# Altium schematic sheet EMMC_SDcard.SchDoc
size A4
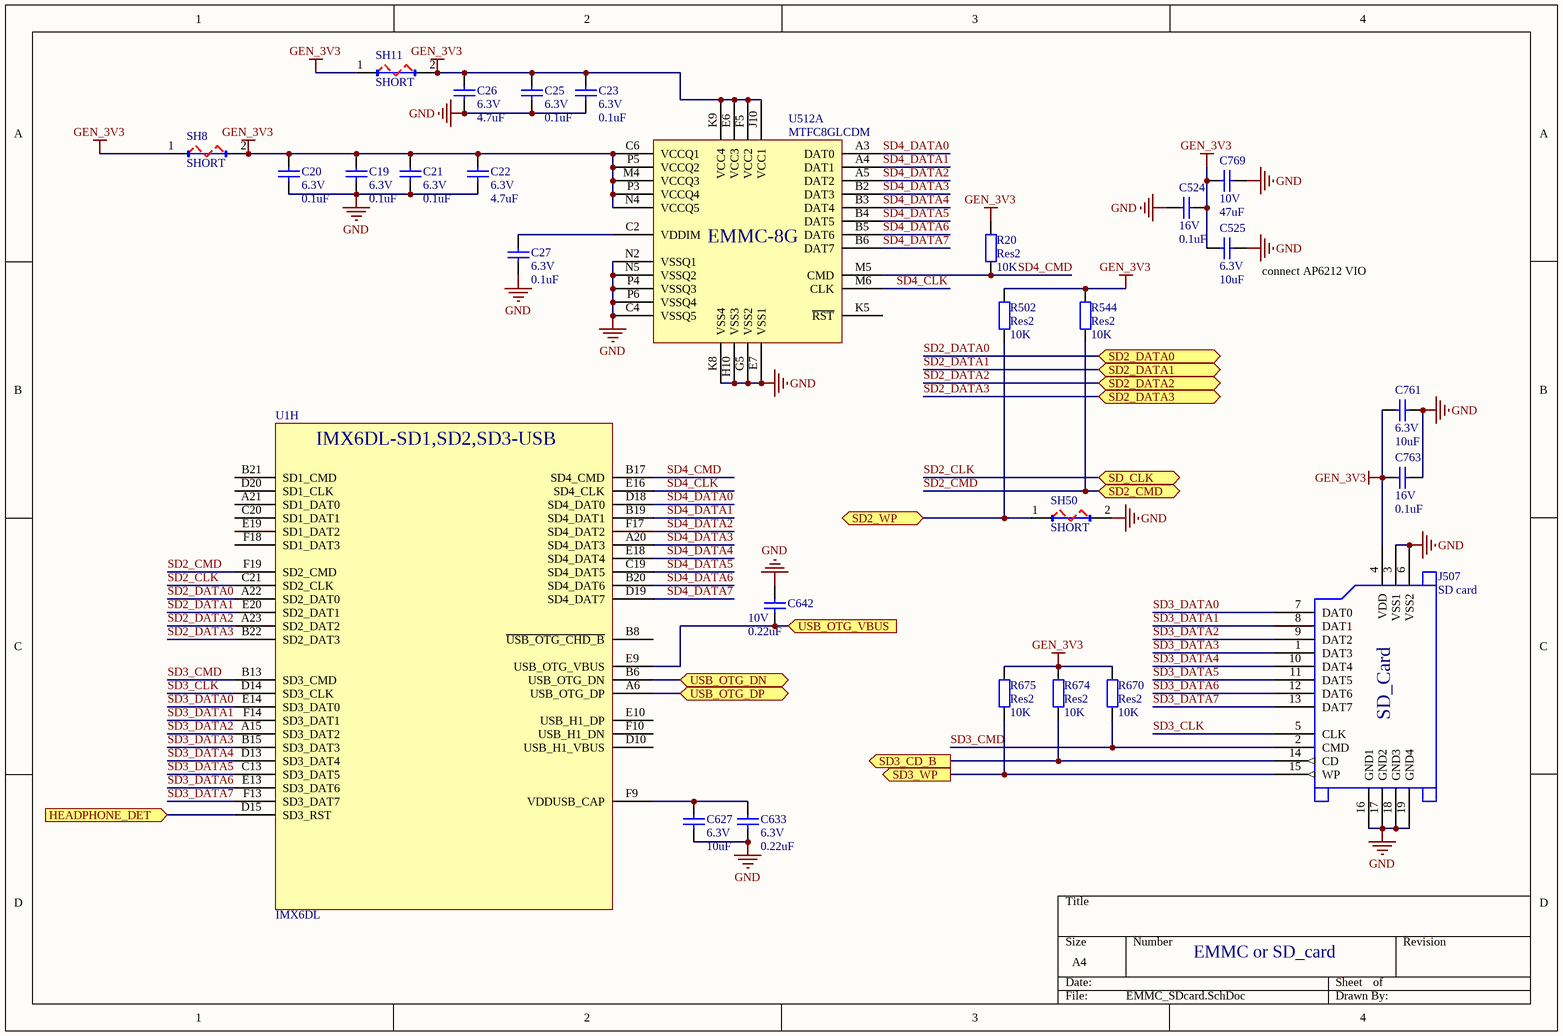
[diagram p0: EMMC_SDcard.SchDoc]

## Parts
C19  6.3V  value 0.1uF  [0201]
C20  6.3V  value 0.1uF  [0201]
C21  6.3V  value 0.1uF  [0201]
C22  6.3V  value 4.7uF  [0603]
C23  6.3V  value 0.1uF  [0201]
C25  6.3V  value 0.1uF  [0201]
C26  6.3V  value 4.7uF  [0603]
C27  6.3V  value 0.1uF  [0201]
C524  16V  value 0.1uF  [0402]
C525  6.3V  value 10uF  [0603]
C627  6.3V  value 10uF  [0603]
C633  6.3V  value 0.22uF  [0201]
C642  10V  value 0.22uF  [0201]
C761  6.3V  value 10uF  [0603]
C763  16V  value 0.1uF  [0402]
C769  10V  value 47uF  [nonpolarity_cap_1206]
J507  SD card  [SD_card]
R20  Res2  value 10K  [0402]
R502  Res2  value 10K  [0402]
R544  Res2  value 10K  [0402]
R670  Res2  value 10K  [0402]
R674  Res2  value 10K  [0402]
R675  Res2  value 10K  [0402]
SH8  SHORT  [SHORT_SH]
SH11  SHORT  [SHORT_SH]
SH50  SHORT  [SHORT_SH]
U1  IMX6DL  [IMX6DL-BGA624x25]  (part H of 8)
U512A  MTFC8GLCDM  [SDIN8DE2-4G-EMMC-BGA153]

## Ports
HEADPHONE_DET (in), SD2_CMD, SD2_DATA0, SD2_DATA1, SD2_DATA2, SD2_DATA3, SD2_WP, SD3_CD_B (out), SD3_WP (out), SD_CLK, USB_OTG_DN, USB_OTG_DP, USB_OTG_VBUS (in)

## Nets
GEN_3V3: C19.2 C20.2 C21.2 C22.2 C23.2 C25.2 C26.2 C524.1 C525.1 C761.1 C763.1 C769.1 J507.4(VDD) R20.2 R502.2 R544.2 R670.2 R674.2 R675.2 SH8.1(VCCIO) SH8.2(VCCIO) SH11.1(VCCIO) SH11.2(VCCIO) U512A.C6(VCCQ1) U512A.E6(VCC3) U512A.F5(VCC2) U512A.J10(VCC1) U512A.K9(VCC4) U512A.M4(VCCQ3) U512A.N4(VCCQ5) U512A.P3(VCCQ4) U512A.P5(VCCQ2)
GND: C19.1 C20.1 C21.1 C22.1 C23.1 C25.1 C26.1 C27.1 C524.2 C525.2 C627.1 C633.1 C642.2 C761.2 C763.2 C769.2 J507.3(VSS1) J507.6(VSS2) J507.16(GND1) J507.17(GND2) J507.18(GND3) J507.19(GND4) SH50.2(VCCIO) U512A.C4(VSSQ5) U512A.E7(VSS1) U512A.G5(VSS2) U512A.H10(VSS3) U512A.K8(VSS4) U512A.N2(VSSQ1) U512A.N5(VSSQ2) U512A.P4(VSSQ3) U512A.P6(VSSQ4)
HEADPHONE_DET: U1.D15(SD3_RST) ; port HEADPHONE_DET
SD2_CLK: U1.C21(SD2_CLK) ; port SD_CLK
SD2_CMD: R544.1 U1.F19(SD2_CMD) ; port SD2_CMD
SD2_DATA0: U1.A22(SD2_DAT0) ; port SD2_DATA0
SD2_DATA1: U1.E20(SD2_DAT1) ; port SD2_DATA1
SD2_DATA2: U1.A23(SD2_DAT2) ; port SD2_DATA2
SD2_DATA3: U1.B22(SD2_DAT3) ; port SD2_DATA3
SD2_WP: R502.1 SH50.1(VCCIO) ; port SD2_WP
SD3_CD_B: J507.14(CD) R674.1 ; port SD3_CD_B
SD3_CLK: J507.5(CLK) U1.D14(SD3_CLK)
SD3_CMD: J507.2(CMD) R670.1 U1.B13(SD3_CMD)
SD3_DATA0: J507.7(DAT0) U1.E14(SD3_DAT0)
SD3_DATA1: J507.8(DAT1) U1.F14(SD3_DAT1)
SD3_DATA2: J507.9(DAT2) U1.A15(SD3_DAT2)
SD3_DATA3: J507.1(DAT3) U1.B15(SD3_DAT3)
SD3_DATA4: J507.10(DAT4) U1.D13(SD3_DAT4)
SD3_DATA5: J507.11(DAT5) U1.C13(SD3_DAT5)
SD3_DATA6: J507.12(DAT6) U1.E13(SD3_DAT6)
SD3_DATA7: J507.13(DAT7) U1.F13(SD3_DAT7)
SD3_WP: J507.15(WP) R675.1 ; port SD3_WP
SD4_CLK: U1.E16(SD4_CLK) U512A.M6(CLK)
SD4_CMD: R20.1 U1.B17(SD4_CMD) U512A.M5(CMD)
SD4_DATA0: U1.D18(SD4_DAT0) U512A.A3(DAT0)
SD4_DATA1: U1.B19(SD4_DAT1) U512A.A4(DAT1)
SD4_DATA2: U1.F17(SD4_DAT2) U512A.A5(DAT2)
SD4_DATA3: U1.A20(SD4_DAT3) U512A.B2(DAT3)
SD4_DATA4: U1.E18(SD4_DAT4) U512A.B3(DAT4)
SD4_DATA5: U1.C19(SD4_DAT5) U512A.B4(DAT5)
SD4_DATA6: U1.B20(SD4_DAT6) U512A.B5(DAT6)
SD4_DATA7: U1.D19(SD4_DAT7) U512A.B6(DAT7)
USB_OTG_DN: U1.B6(USB_OTG_DN) ; port USB_OTG_DN
USB_OTG_DP: U1.A6(USB_OTG_DP) ; port USB_OTG_DP
USB_OTG_VBUS: C642.1 U1.E9(USB_OTG_VBUS) ; port USB_OTG_VBUS
NetC27_2: C27.2 U512A.C2(VDDIM)
NetC627_2: C627.2 C633.2 U1.F9(VDDUSB_CAP)

Not connected (* = marked no-connect by the designer): U1 A21(SD1_DAT0) B8(~{USB_OTG_CHD_B}) B21(SD1_CMD) C20(SD1_DAT1) D10(USB_H1_VBUS) D20(SD1_CLK) E10(USB_H1_DP) E19(SD1_DAT2) F10(USB_H1_DN) F18(SD1_DAT3); U512A K5(~{RST})

## Notes on the sheet
- (near C525) connect AP6212 VIO
- EMMC or SD_card
- (in symbol IMX6DL, part H) IMX6DL-SD1,SD2,SD3-USB
- (in symbol MTFC8GLCDM-emmc) EMMC-8G
- (in symbol SD card) SD_Card

## Library data of the parts
C19-C23 C25-C27 C524 C525 C627 C633 C642 C761 C763 C769 = Cap: Capacitor; Published: 8-Jun-2000; LatestRevisionDate: 17-Jul-2002; LatestRevisionNote: Re-released for DXP Platform.; PackageReference: RAD-0.3; Publisher: Altium Limited
R20 R502 R544 R670 R674 R675 = Res2: Resistor; Published: 8-Jun-2000; LatestRevisionDate: 17-Jul-2002; LatestRevisionNote: Re-released for DXP Platform.; PackageReference: AXIAL-0.4; Publisher: Altium Limited
SH8 SH11 SH50 = SOLDER SHORT
U512A = MTFC8GLCDM-emmc